# EAGLE design EHT_Dimmer (EAGLE 7.2.0)
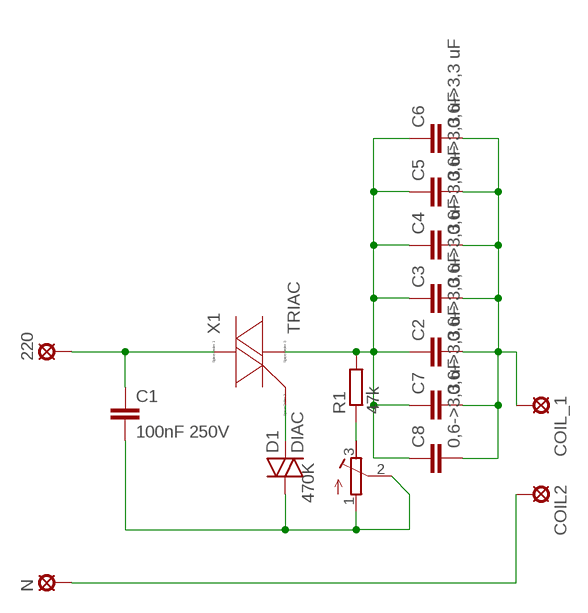
[diagram p0: schematic, sheet 1]

## Parts
220  LSP10  [LSP10]
470K  R-TRIMM3339P  [RTRIM3339P]
C1  100nF 250V  C-EU102_152-062X184  [C102_152-062X184]
C2  0,6->3,3 uF  C-EU102_152-062X184  [C102_152-062X184]
C3  0,6->3,3 uF  C-EU102_152-062X184  [C102_152-062X184]
C4  0,6->3,3 uF  C-EU102_152-062X184  [C102_152-062X184]
C5  0,6->3,3 uF  C-EU102_152-062X184  [C102_152-062X184]
C6  0,6->3,3 uF  C-EU102_152-062X184  [C102_152-062X184]
C7  0,6->3,3 uF  C-EU102_152-062X184  [C102_152-062X184]
C8  0,6->3,3 uF  C-EU102_152-062X184  [C102_152-062X184]
COIL2  LSP10  [LSP10]
COIL_1  LSP10  [LSP10]
D1  DIAC  DIAC-GT32  [GT32]
N  LSP10  [LSP10]
R1  47k  R-EU_0207/10  [0207/10]
X1  TRIAC  [BR220S]

## Nets
N$1: 220.MP C1.1 X1.T3(MT2)
N$2: C2.1 C3.1 C4.1 C5.1 C6.1 C7.1 C8.1 R1.2 X1.T2(MT1)
N$3: 470K.3(E) R1.1
N$4: 470K.1(A) 470K.2(S) C1.2 D1.1
N$7: D1.2 X1.T1(G)
N$22: C2.2 C3.2 C4.2 C5.2 C6.2 C7.2 C8.2 COIL_1.MP
N$24: COIL2.MP N.MP

## Library data of the parts
220 COIL2 COIL_1 N = solpad:LSP10: SOLDER PAD drill 1.0 mm, distributor Buerklin, 12H555
470K = resistor:R-TRIMM: Trimm resistor
C1-C8 = rcl:C-EU: CAPACITOR, European symbol
D1 = diode:DIAC-: DIAC
R1 = rcl:R-EU_: RESISTOR, European symbol
X1 = Misc:TRIAC: Generic TRIAC symbol for use with a model that you supply.

## Board
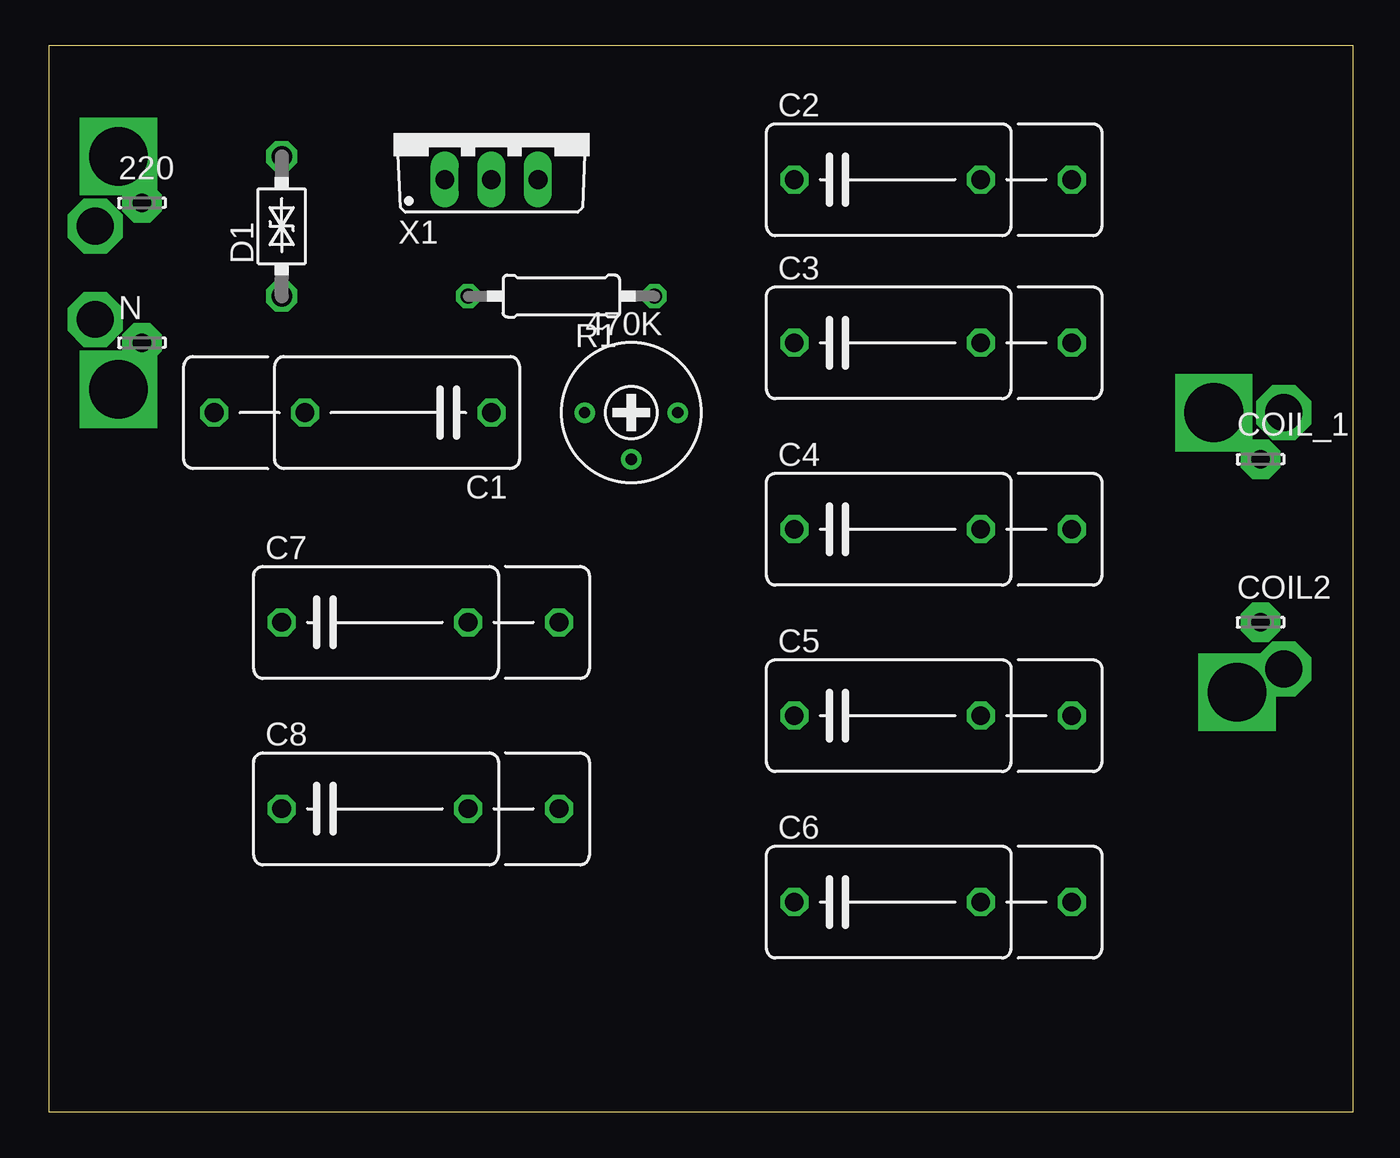
[diagram p1: board, top side]
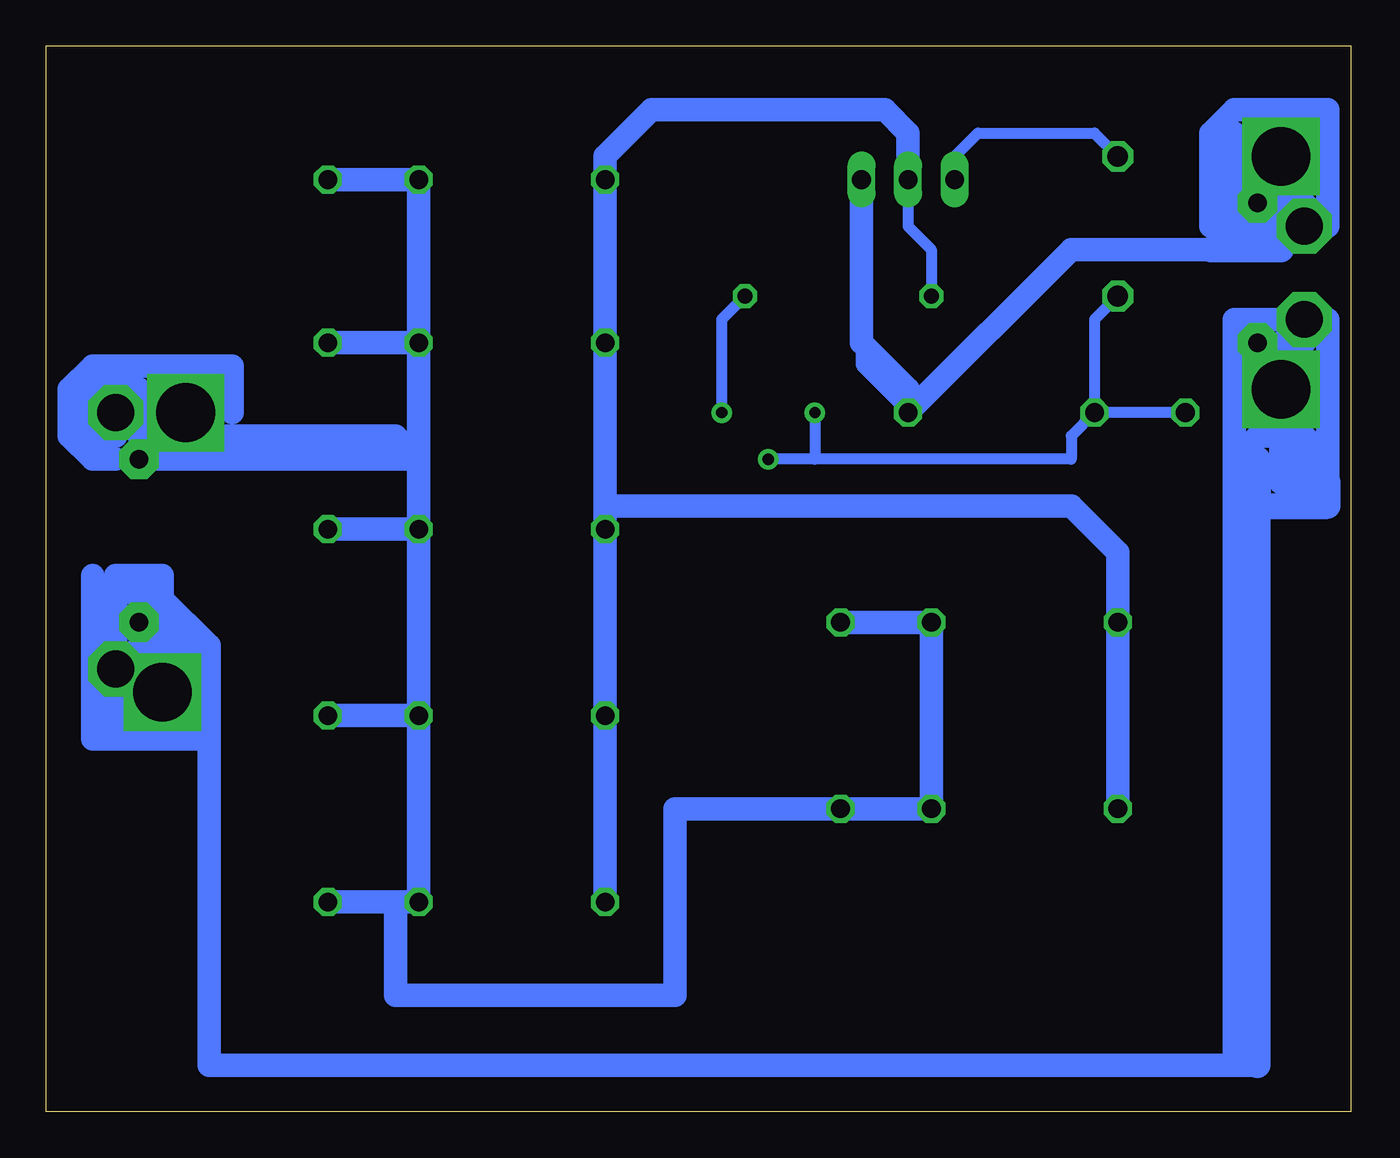
[diagram p2: board, bottom side, seen from below]

Size 71.1 x 58.09 mm. Coordinates in mm from the lower left corner, seen from the top.
Outline: 0,0 71.1,0 71.1,58.09 0,58.09 0,0
Copper layers (1*16): Top 0.035mm / dielectric 1.5mm / Bottom 0.035mm
Design rules "default": minimum track width 10mil, minimum drill 24mil, track to track 8mil, track to pad 8mil, pad to pad 8mil, via to via 8mil, smd to smd 8mil, copper to edge 40mil, drill to drill 8mil, minimum pad ring 10mil, minimum via ring 8mil, stop-mask expansion 4mil, vias tented up to drill 0mil, thermal gap 10mil

### Footprints (pad centres in the part's own frame; a part is rotated, then mirrored left to right if it is on the bottom)
LSP10 = drill 1.016 pad 2.159 octagon: MP 0,0
RTRIM3339P = drill 0.61: 1 -2.54,0; 2 0,-2.54; 3 2.54,0
C102_152-062X184 = drill 1.016 octagon: 1 -5.08,0; 2 5.08,0; 3 10.033,0
GT32 = drill 1.118 octagon: 1 -3.81,0; 2 3.81,0
0207/10 = drill 0.813 octagon: 1 -5.08,0; 2 5.08,0
BR220S = drill 1.016 long: T1 -2.54,-2.54; T2 0,-2.54; T3 2.54,-2.54

### Placement (x,y rotation side)
220  5.08,49.53 0 top
470K  31.75,38.1 0 top
C1  19.05,38.1 180 top
C2  45.72,50.8 0 top
C3  45.72,41.91 0 top
C4  45.72,31.75 0 top
C5  45.72,21.59 0 top
C6  45.72,11.43 0 top
C7  17.78,26.67 0 top
C8  17.78,16.51 0 top
COIL2  66.04,26.67 0 top
COIL_1  66.04,35.56 0 top
D1  12.7,48.26 90 top
N  5.08,41.91 0 top
R1  27.94,44.45 180 top
X1  24.13,53.34 0 top

### Tracks (layer width: path | path; a pad name or v marks a point on that pad's centre or on a via)
N$1
  Bottom 0.61: C1.1 26.67,40.64 26.67,41.91 | 26.67,49.53 X1.T3
  Bottom 1.27: 6.35,53.34 6.35,49.53 7.62,48.26 7.62,53.34 6.35,54.61 1.27,54.61 1.27,48.26 2.54,49.53 220.MP 6.35,48.26 7.62,46.99 15.24,46.99 C1.1 24.13,39.37 26.67,41.91 26.67,49.53
  Bottom 1.422: 3.81,46.99 6.35,46.99 | 6.35,46.99 6.35,48.26 3.81,48.26 | 6.35,46.99 7.62,46.99
N$2
  Bottom 0.61: X1.T2 24.13,48.26 22.86,46.99 R1.2 | 40.64,49.53 C3.1 40.64,34.29 | 40.64,33.02 C4.1 C5.1 C6.1 | C8.1 C7.1 12.7,30.48
  Bottom 1.27: C8.1 12.7,30.48 15.24,33.02 40.64,33.02 | C4.1 C6.1 40.64,34.29 40.64,49.53 C2.1 40.64,52.07 38.1,54.61 25.4,54.61 24.13,53.34 X1.T2
N$3
  Bottom 0.61: R1.1 34.29,43.18 470K.3
N$4
  Bottom 0.61: D1.1 13.97,43.18 C1.2 | 8.89,38.1 C1.2 | C1.2 15.24,36.83 15.24,35.56 29.21,35.56 | 29.21,35.56 470K.2 | 470K.1 29.21,35.56
N$7
  Bottom 0.61: X1.T1 21.59,52.07 20.32,53.34 13.97,53.34 D1.2
N$11  (via drill 3.2)
  other vias: 64.77,22.86
N$12  (via drill 3.2)
  other vias: 63.5,38.1
N$13  (via drill 3.2)
  other vias: 3.81,39.37
N$14  (via drill 3.2)
  other vias: 3.81,52.07
N$15  (via drill 2)
  other vias: 2.54,48.26
N$16  (via drill 2)
  other vias: 2.54,43.18
N$17  (via drill 2)
  other vias: 67.31,38.1
N$18  (via drill 2)
  other vias: 67.31,24.13
N$19
  Bottom 1.27: 64.77,25.4 66.04,25.4
N$20
  Bottom 1.27: 2.54,41.91 3.81,41.91
N$21
  Bottom 1.27: 64.77,36.83 66.04,36.83 66.04,39.37 68.58,39.37 68.58,36.83 67.31,36.83
N$22
  Bottom 0.61: 52.07,35.56 50.8,35.56
  Bottom 1.27: 62.23,36.83 52.07,36.83 50.8,35.56 | COIL_1.MP 53.34,35.56 52.07,35.56 50.8,35.56 | C3.2 C2.2 55.88,50.8 | C3.2 50.8,35.56 | 50.8,35.56 C4.2 | C4.2 C5.2 | C5.2 C6.2 52.07,11.43 | 52.07,11.43 55.88,11.43 | 52.07,11.43 52.07,6.35 36.83,6.35 36.83,16.51 C8.2 C7.2 27.94,26.67 | C3.2 55.88,41.91 | C4.2 55.88,31.75 | C5.2 55.88,21.59
N$24
  Bottom 1.27: 67.31,25.4 67.31,29.21 | 67.31,29.21 66.04,27.94 64.77,27.94 62.23,25.4 62.23,24.13 | 67.31,22.86 67.31,20.32 | 5.08,2.54 6.35,2.54 | 6.35,2.54 62.23,2.54 62.23,20.32 | 62.23,20.32 62.23,24.13 | 62.23,24.13 COIL2.MP | 67.31,20.32 62.23,20.32 | 62.23,24.13 64.77,26.67 64.77,29.21 67.31,29.21 | 68.58,29.21 68.58,20.32 67.31,20.32 | N.MP 6.35,41.91 6.35,2.54 | 3.81,43.18 6.35,43.18 6.35,35.56 5.08,36.83 3.81,36.83 | 3.81,36.83 2.54,36.83 1.27,35.56 | 1.27,35.56 1.27,34.29 2.54,34.29 | 2.54,34.29 3.81,34.29 3.81,35.56 | 3.81,35.56 2.54,35.56 2.54,34.29 | 2.54,34.29 3.81,35.56 | 3.81,35.56 3.81,36.83 | 1.27,35.56 1.27,43.18
  Bottom 1.422: 5.08,2.54 5.08,33.02 | 5.08,35.56 5.08,33.02 | 5.08,33.02 1.27,33.02 1.27,34.29
N$26
  Bottom 1.27: 60.96,38.1 60.96,40.64 68.58,40.64 69.85,39.37 69.85,36.83 68.58,35.56 67.31,35.56